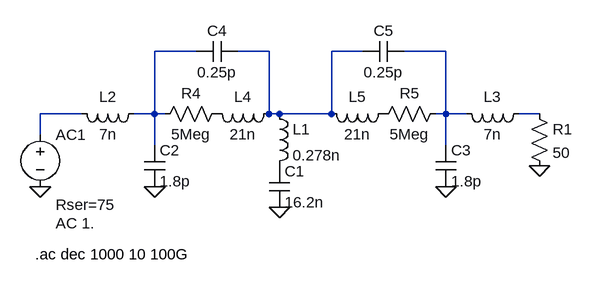
[diagram p0: schematic SHVFeedthroughFilter.asc]
SHVFeedthroughFilter.asc, the LTspice schematic file:
Version 4
SHEET 1 1000 680
WIRE 32 -80 -32 -80
WIRE 144 -80 96 -80
WIRE 288 -80 240 -80
WIRE 416 -80 352 -80
WIRE -144 16 -208 16
WIRE -32 16 -32 -80
WIRE -32 16 -64 16
WIRE -16 16 -32 16
WIRE 144 16 144 -80
WIRE 160 16 144 16
WIRE 240 16 240 -80
WIRE 240 16 160 16
WIRE 416 16 416 -80
WIRE 416 16 400 16
WIRE 448 16 416 16
WIRE 560 16 528 16
WIRE -208 48 -208 16
WIRE -32 64 -32 16
WIRE 416 64 416 16
FLAG -208 128 0
FLAG 160 160 0
FLAG 560 96 0
FLAG -32 128 0
FLAG 416 128 0
SYMBOL cap 144 96 R0
SYMATTR InstName C1
SYMATTR Value 16.2n
SYMBOL ind 144 0 R0
SYMATTR InstName L1
SYMATTR Value 0.278n
SYMBOL cap 96 -96 R90
WINDOW 0 0 32 VBottom 2
WINDOW 3 32 32 VTop 2
SYMATTR InstName C4
SYMATTR Value 0.25p
SYMBOL cap 352 -96 R90
WINDOW 0 0 32 VBottom 2
WINDOW 3 32 32 VTop 2
SYMATTR InstName C5
SYMATTR Value 0.25p
SYMBOL res 80 0 R90
WINDOW 0 0 56 VBottom 2
WINDOW 3 32 56 VTop 2
SYMATTR InstName R4
SYMATTR Value 5Meg
SYMBOL res 416 0 R90
WINDOW 0 0 56 VBottom 2
WINDOW 3 32 56 VTop 2
SYMATTR InstName R5
SYMATTR Value 5Meg
SYMBOL ind 160 0 R90
WINDOW 0 5 56 VBottom 2
WINDOW 3 32 56 VTop 2
SYMATTR InstName L4
SYMATTR Value 21n
SYMBOL ind -48 0 R90
WINDOW 0 5 56 VBottom 2
WINDOW 3 32 56 VTop 2
SYMATTR InstName L2
SYMATTR Value 7n
SYMBOL ind 544 0 R90
WINDOW 0 5 56 VBottom 2
WINDOW 3 32 56 VTop 2
SYMATTR InstName L3
SYMATTR Value 7n
SYMBOL ind 336 0 R90
WINDOW 0 5 56 VBottom 2
WINDOW 3 32 56 VTop 2
SYMATTR InstName L5
SYMATTR Value 21n
SYMBOL voltage -208 32 R0
WINDOW 3 24 152 Left 2
WINDOW 123 24 152 Left 2
WINDOW 39 24 124 Left 2
SYMATTR Value ""
SYMATTR Value2 AC 1.
SYMATTR SpiceLine Rser=75
SYMATTR InstName AC1
SYMBOL res 544 0 R0
SYMATTR InstName R1
SYMATTR Value 50
SYMBOL cap -48 64 R0
SYMATTR InstName C2
SYMATTR Value 1.8p
SYMBOL cap 400 64 R0
SYMATTR InstName C3
SYMATTR Value 1.8p
TEXT -216 232 Left 2 !.ac dec 1000 10 100G

The netlist it stands for:
* SHVFeedthroughFilter.asc
C1 P001 0 16.2n
L1 N002 P001 0.278n
C4 N002 N001 0.25p
C5 N003 N002 0.25p
R4 P002 N001 5Meg
R5 N003 P003 5Meg
L4 N002 P002 21n
L2 N001 N004 7n
L3 N005 N003 7n
L5 P003 N002 21n
V§AC1 N004 0 AC 1. Rser=75
R1 N005 0 50
C2 N001 0 1.8p
C3 N003 0 1.8p
.ac dec 1000 10 100G
.backanno
.end